# Altium schematic sheet DecoderCircuit_M1.SchDoc
size A3; SheetNumber: 2; SheetTotal: 2; SPICEModelCacheMPTCKVRP: <root> / <DocumentId>MPTCKVRP</DocumentId> / <CacheFrame Number="0"> / <Model Name="sn74f08" Kind="MDL"> / <Text>*Texas Instruments / *SN74F08: FAST Quad 2-input AND / .MODEL SN74F08 xsimcode(file="{MODEL_PATH}FAST.SCB" func=f08 {mntymx})</Text> / </Model> / <Model Name="sn74f74" Kind="MDL"> / <Text>*Texas Instruments / *SN74F74: Dual Positive-Edge-Triggered D-Type Flip-Flop with Clear and Preset / .MODEL SN74F74 xsimcode(file="{MODEL_PATH}FAST.SCB" func=f74 {mntymx})</Text> / </Model> / <Model Name="sn74f32" Kind="MDL"> / <Text>*Texas Instruments / *SN74F32: FAST Quad 2-in OR / .MODEL SN74F32 xsimcode(file="{MODEL_PATH}FAST.SCB" func=f32 {mntymx})</Text> / </Model> / <Model Name="sn74ls04" Kind="MDL"> / <Text>*Texas Instruments / *SN74LS04: LS Hex Inverter / .MODEL SN74LS04 xsimcode(file="{MODEL_PATH}LS.SCB" func=ls04 {mntymx})</Text> / </Model> / </CacheFrame> / </root>
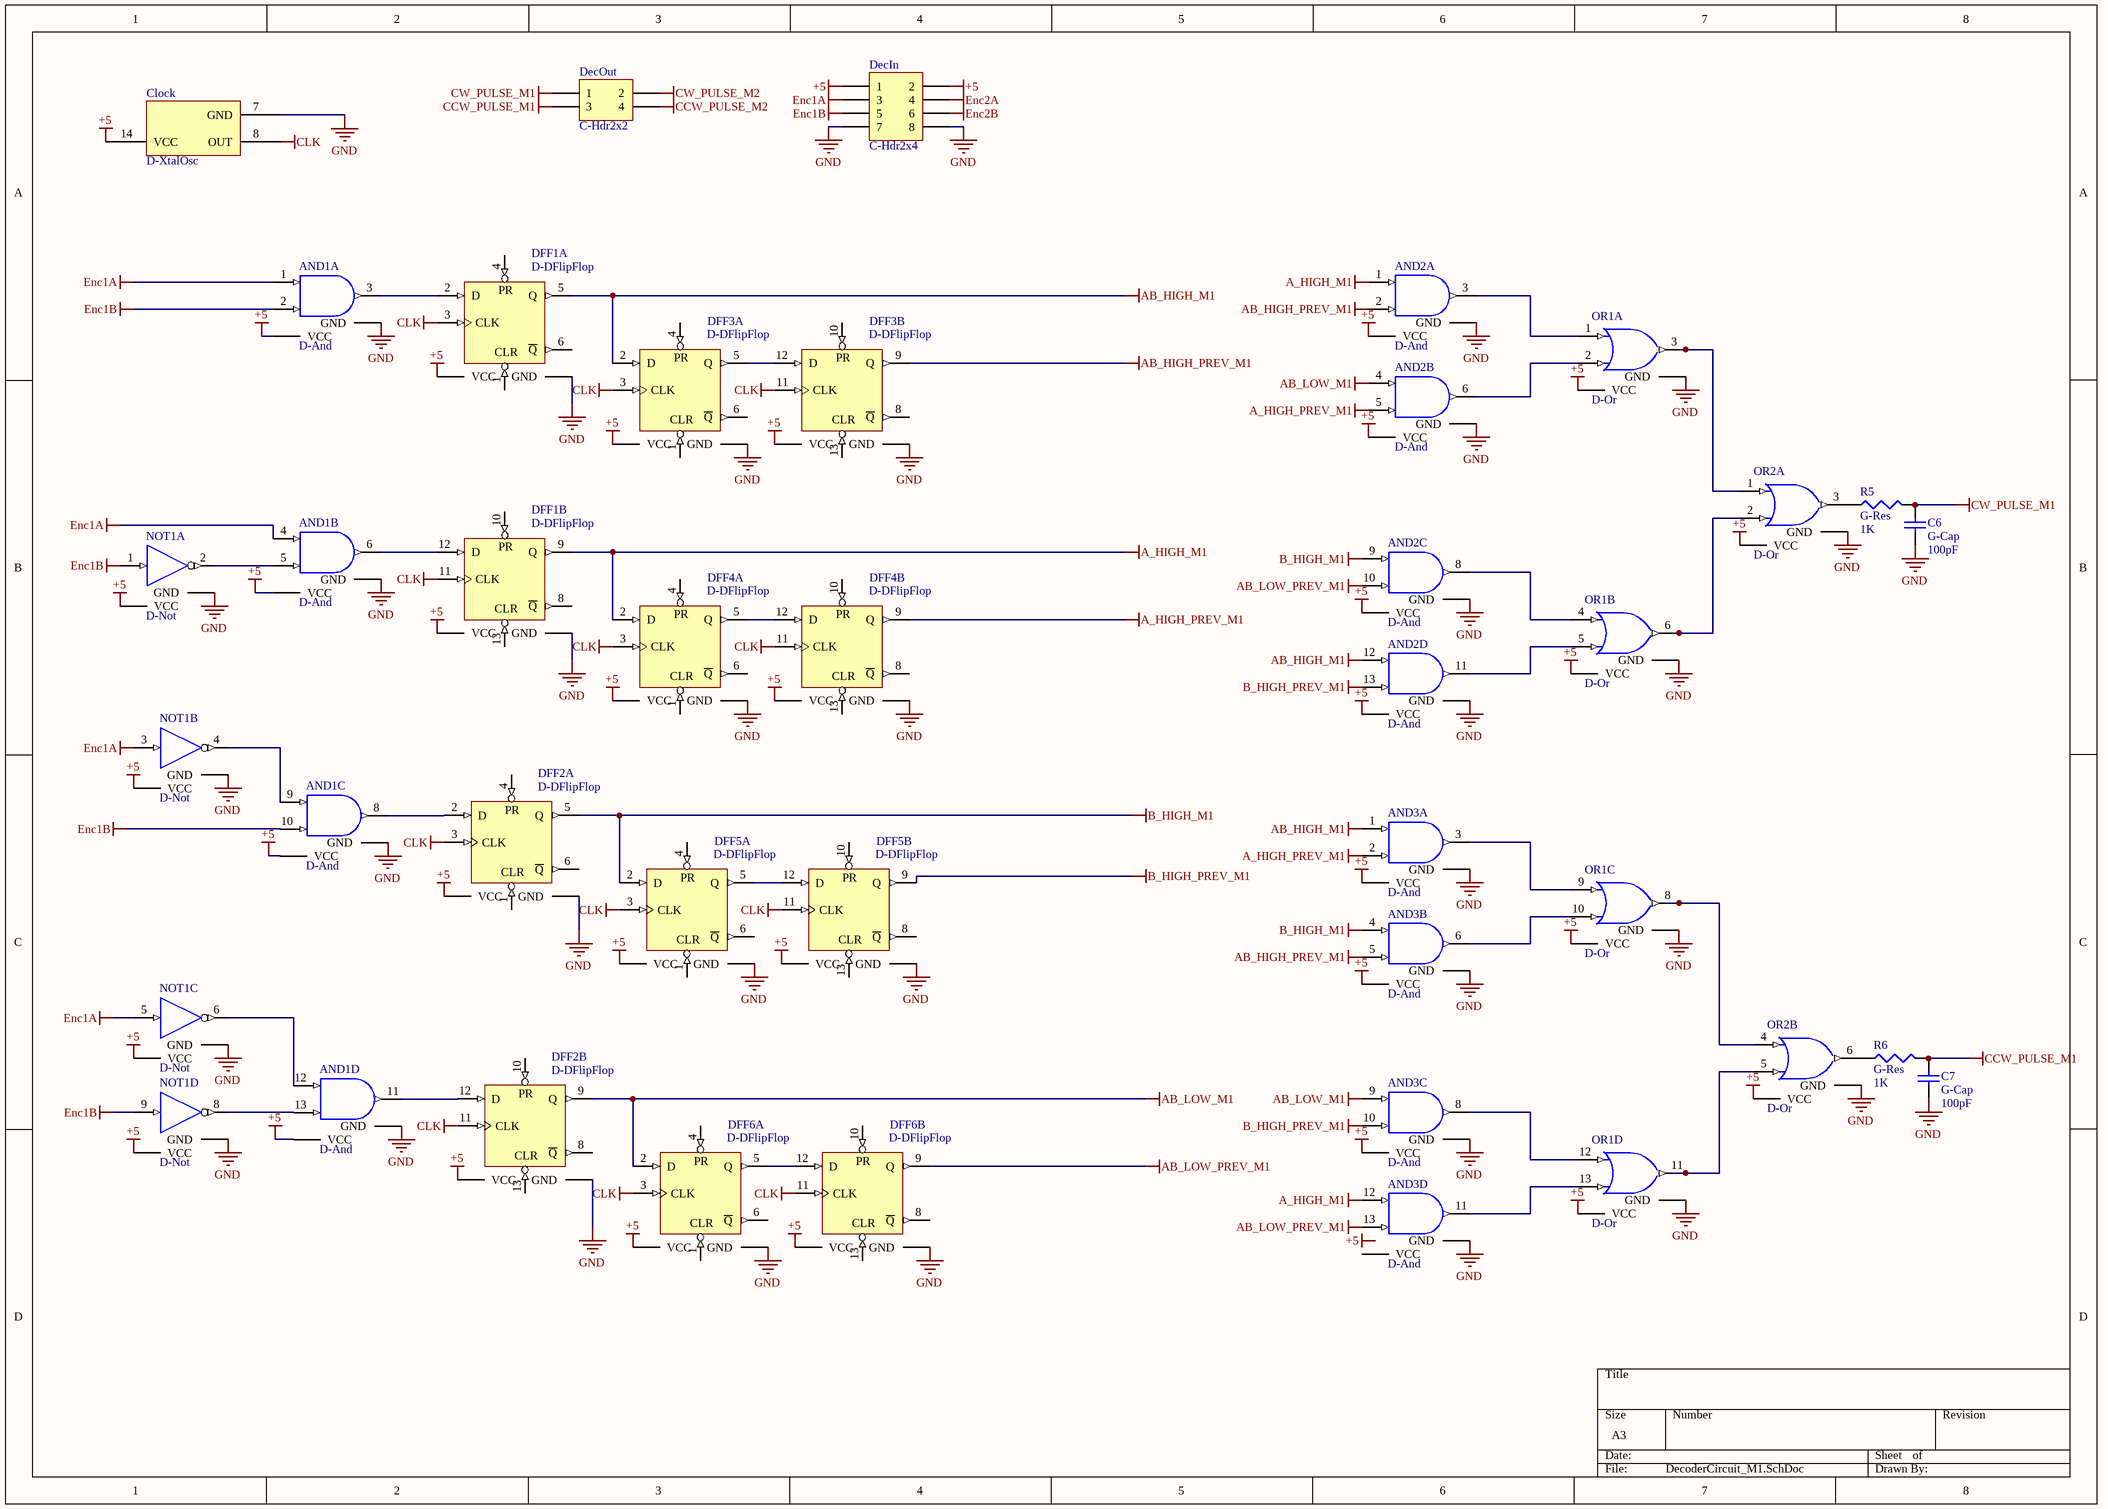
[diagram p0: DecoderCircuit_M1.SchDoc]

## Parts
AND1  D-And  [DIP14_LGE1.0]  (parts A,B,C,D of 4)
AND2  D-And  [DIP14_LGE1.0]  (parts A,B,C,D of 4)
AND3  D-And  [DIP14_LGE1.0]  (parts A,B,C,D of 4)
C6  G-Cap  value 100pF  [Cap2.54mm_LGE1.0]
C7  G-Cap  value 100pF  [Cap2.54mm_LGE1.0]
Clock  D-XtalOsc  [4Lead Osc_LGE1.0]
DecIn  C-Hdr2x4  [HDR2X4_LGE1.0]
DecOut  C-Hdr2x2  [HDR2X2_LGE1.0]
DFF1  D-DFlipFlop  [DIP14_LGE1.0]  (parts A,B of 2)
DFF2  D-DFlipFlop  [DIP14_LGE1.0]  (parts A,B of 2)
DFF3  D-DFlipFlop  [DIP14_LGE1.0]  (parts A,B of 2)
DFF4  D-DFlipFlop  [DIP14_LGE1.0]  (parts A,B of 2)
DFF5  D-DFlipFlop  [DIP14_LGE1.0]  (parts A,B of 2)
DFF6  D-DFlipFlop  [DIP14_LGE1.0]  (parts A,B of 2)
NOT1  D-Not  [DIP14_LGE1.0]  (parts A,B,C,D of 6)
OR1  D-Or  [DIP14_LGE1.0]  (parts A,B,C,D of 4)
OR2  D-Or  [DIP14_LGE1.0]  (parts A,B of 4)
R5  G-Res  value 1K  [Res10mm_LGE1.0]
R6  G-Res  value 1K  [Res10mm_LGE1.0]

## Nets
+5: AND1.14(VCC) AND2.14(VCC) AND3.14(VCC) Clock.14(VCC) DecIn.1 DecIn.2 DFF1.14(VCC) DFF2.14(VCC) DFF3.14(VCC) DFF4.14(VCC) DFF5.14(VCC) DFF6.14(VCC) NOT1.14(VCC) OR1.14(VCC) OR2.14(VCC)
A_HIGH_M1: AND2.1(A) AND3.12(A) DFF1.9(Q) DFF4.2(D)
A_HIGH_PREV_M1: AND2.5(B) AND3.2(B) DFF4.9(Q)
AB_HIGH_M1: AND2.12(A) AND3.1(A) DFF1.5(Q) DFF3.2(D)
AB_HIGH_PREV_M1: AND2.2(B) AND3.5(B) DFF3.9(Q)
AB_LOW_M1: AND2.4(A) AND3.9(A) DFF2.9(Q) DFF6.2(D)
AB_LOW_PREV_M1: AND2.10(B) AND3.13(B) DFF6.9(Q)
B_HIGH_M1: AND2.9(A) AND3.4(A) DFF2.5(Q) DFF5.2(D)
B_HIGH_PREV_M1: AND2.13(B) AND3.10(B) DFF5.9(Q)
CCW_PULSE_M1: C7.1 DecOut.3 R6.2
CCW_PULSE_M2: DecOut.4
CLK: Clock.8(OUT) DFF1.3(CLK) DFF1.11(CLK) DFF2.3(CLK) DFF2.11(CLK) DFF3.3(CLK) DFF3.11(CLK) DFF4.3(CLK) DFF4.11(CLK) DFF5.3(CLK) DFF5.11(CLK) DFF6.3(CLK) DFF6.11(CLK)
CW_PULSE_M1: C6.1 DecOut.1 R5.2
CW_PULSE_M2: DecOut.2
Enc1A: AND1.1(A) AND1.4(A) DecIn.3 NOT1.3(A) NOT1.5(A)
Enc1B: AND1.2(B) AND1.10(B) DecIn.5 NOT1.1(A) NOT1.9(A)
Enc2A: DecIn.4
Enc2B: DecIn.6
GND: AND1.7(GND) AND2.7(GND) AND3.7(GND) C6.2 C7.2 Clock.7(GND) DecIn.7 DecIn.8 DFF1.7(GND) DFF2.7(GND) DFF3.7(GND) DFF4.7(GND) DFF5.7(GND) DFF6.7(GND) NOT1.7(GND) OR1.7(GND) OR2.7(GND)
NetAND1_3: AND1.3(Y) DFF1.2(D)
NetAND1_5: AND1.5(B) NOT1.2(Y)
NetAND1_6: AND1.6(Y) DFF1.12(D)
NetAND1_8: AND1.8(Y) DFF2.2(D)
NetAND1_9: AND1.9(A) NOT1.4(Y)
NetAND1_11: AND1.11(Y) DFF2.12(D)
NetAND1_12: AND1.12(A) NOT1.6(Y)
NetAND1_13: AND1.13(B) NOT1.8(Y)
NetAND2_3: AND2.3(Y) OR1.1(A)
NetAND2_6: AND2.6(Y) OR1.2(B)
NetAND2_8: AND2.8(Y) OR1.4(A)
NetAND2_11: AND2.11(Y) OR1.5(B)
NetAND3_3: AND3.3(Y) OR1.9(A)
NetAND3_6: AND3.6(Y) OR1.10(B)
NetAND3_8: AND3.8(Y) OR1.12(A)
NetAND3_11: AND3.11(Y) OR1.13(B)
NetDFF3_5: DFF3.5(Q) DFF3.12(D)
NetDFF4_5: DFF4.5(Q) DFF4.12(D)
NetDFF5_5: DFF5.5(Q) DFF5.12(D)
NetDFF6_5: DFF6.5(Q) DFF6.12(D)
NetOR1_3: OR1.3(Y) OR2.1(A)
NetOR1_6: OR1.6(Y) OR2.2(B)
NetOR1_8: OR1.8(Y) OR2.4(A)
NetOR1_11: OR1.11(Y) OR2.5(B)
NetOR2_3: OR2.3(Y) R5.1
NetOR2_6: OR2.6(Y) R6.1

Not connected (* = marked no-connect by the designer): Clock 1(NC); DFF1 1(CLR) 4(PR) 6(~{Q}) 8(~{Q}) 10(PR) 13(CLR); DFF2 1(CLR) 4(PR) 6(~{Q}) 8(~{Q}) 10(PR) 13(CLR); DFF3 1(CLR) 4(PR) 6(~{Q}) 8(~{Q}) 10(PR) 13(CLR); DFF4 1(CLR) 4(PR) 6(~{Q}) 8(~{Q}) 10(PR) 13(CLR); DFF5 1(CLR) 4(PR) 6(~{Q}) 8(~{Q}) 10(PR) 13(CLR); DFF6 1(CLR) 4(PR) 6(~{Q}) 8(~{Q}) 10(PR) 13(CLR)

## Notes on the sheet
- Labels drawn without touching a wire or pin: +5

## Library data of the parts
AND1-AND3 = D-And: Quad 2-input AND gate; Published: 8-Jun-2000; LatestRevisionDate: 04-Mar-2005; LatestRevisionNote: Stylized 3D Model Added.; DatasheetVersion: Oct-1993; PackageVersion: Oct-1995; PackageReference: N014; Publisher: Altium Limited; PackageDescription: DIP; 14 Leads; Row Spacing 7.62 mm; Pitch 2.54 mm; ComponentLink1Description: Manufacturer Link; ComponentLink1URL: http://www.ti.com/; ComponentLink2Description: Datasheet; ComponentLink2URL: http://www-s.ti.com/sc/ds/SN74F08.pdf; ComponentLink3URL: http://www.ti.com/lit/ds/symlink/cd74hct08.pdf; ComponentLink3Description: Datasheet (ELEC391)
C6 C7 = G-Cap: Capacitor (specify value); Published: 8-Jun-2000; LatestRevisionDate: 17-Jul-2002; LatestRevisionNote: Re-released for DXP Platform.; PackageReference: RAD-0.3; Publisher: Altium Limited
Clock = D-XtalOsc: Crystal Oscillator; Published: 8-Jun-2000; LatestRevisionDate: 17-Jul-2002; LatestRevisionNote: Re-released for DXP Platform.; PackageReference: R38; Publisher: Altium Limited; ComponentLink1URL: http://www.ecsxtal.com/store/pdf/ecs_100.pdf; ComponentLink1Description: Datasheet (ELEC391)
DecIn = C-Hdr2x4: Header, 4-Pin, Dual row; LatestRevisionDate: 17-Jul-2002; LatestRevisionNote: Re-released for DXP Platform.; Publisher: Altium Limited
DecOut = C-Hdr2x2: Header, 2-Pin, Dual row; LatestRevisionDate: 17-Jul-2002; LatestRevisionNote: Re-released for DXP Platform.; Publisher: Altium Limited
DFF1-DFF6 = D-DFlipFlop: Dual D flip-flop; Published: 8-Jun-2000; LatestRevisionDate: 04-Mar-2005; LatestRevisionNote: Stylized 3D Model Added.; DatasheetVersion: Oct-1993; PackageVersion: Jun-1999; PackageReference: J014; Publisher: Altium Limited; PackageDescription: DIP; 14 Leads; Row Spacing 7.62 mm; Pitch 2.54 mm; ComponentLink1Description: Manufacturer Link; ComponentLink1URL: http://www.ti.com/; ComponentLink2Description: Datasheet; ComponentLink2URL: http://www-s.ti.com/sc/ds/sn74f74.pdf; ComponentLink3URL: http://www.ti.com/lit/ds/symlink/sn74hct74.pdf; ComponentLink3Description: Datasheet (ELEC391)
NOT1 = D-Not: Hex NOT gate (inverter); Published: 8-Jun-2000; LatestRevisionDate: 04-Mar-2005; LatestRevisionNote: Stylized 3D Model Added.; DatasheetVersion: Mar-1988; PackageVersion: Oct-1995; PackageReference: N014; Publisher: Altium Limited; PackageDescription: DIP; 14 Leads; Row Spacing 7.62 mm; Pitch 2.54 mm; ComponentLink1Description: Manufacturer Link; ComponentLink1URL: http://www.ti.com/; ComponentLink2Description: Datasheet; ComponentLink2URL: http://www-s.ti.com/sc/ds/sn74ls04.pdf; ComponentLink3URL: http://media.digikey.com/pdf/Data%20Sheets/ST%20Microelectronics%20PDFS/M74HCT04.pdf; ComponentLink3Description: Datasheet (ELEC391)
OR1 OR2 = D-Or: Quad 2-input OR gate; Published: 8-Jun-2000; LatestRevisionDate: 04-Mar-2005; LatestRevisionNote: Stylized 3D Model Added.; DatasheetVersion: May-1999; PackageVersion: Oct-1995; PackageReference: N014; Publisher: Altium Limited; PackageDescription: DIP; 14 Leads; Row Spacing 7.62 mm; Pitch 2.54 mm; ComponentLink1Description: Manufacturer Link; ComponentLink1URL: http://www.ti.com/; ComponentLink2Description: Datasheet; ComponentLink2URL: http://www-s.ti.com/sc/ds/SN54F32.pdf; ComponentLink3URL: http://media.digikey.com/pdf/Data%20Sheets/ST%20Microelectronics%20PDFS/M74HCT32.pdf; ComponentLink3Description: Datasheet (ELEC391)
R5 R6 = G-Res: Resistor (specify value); Published: 8-Jun-2000; LatestRevisionDate: 29-May-2009; LatestRevisionNote: IPC-7351 Footprint Added.; PackageReference: J1-0603; Publisher: Altium Limited; PackageDescription: Chip Resistor